# EAGLE design dawa_v5.1 (EAGLE 7.4.0)
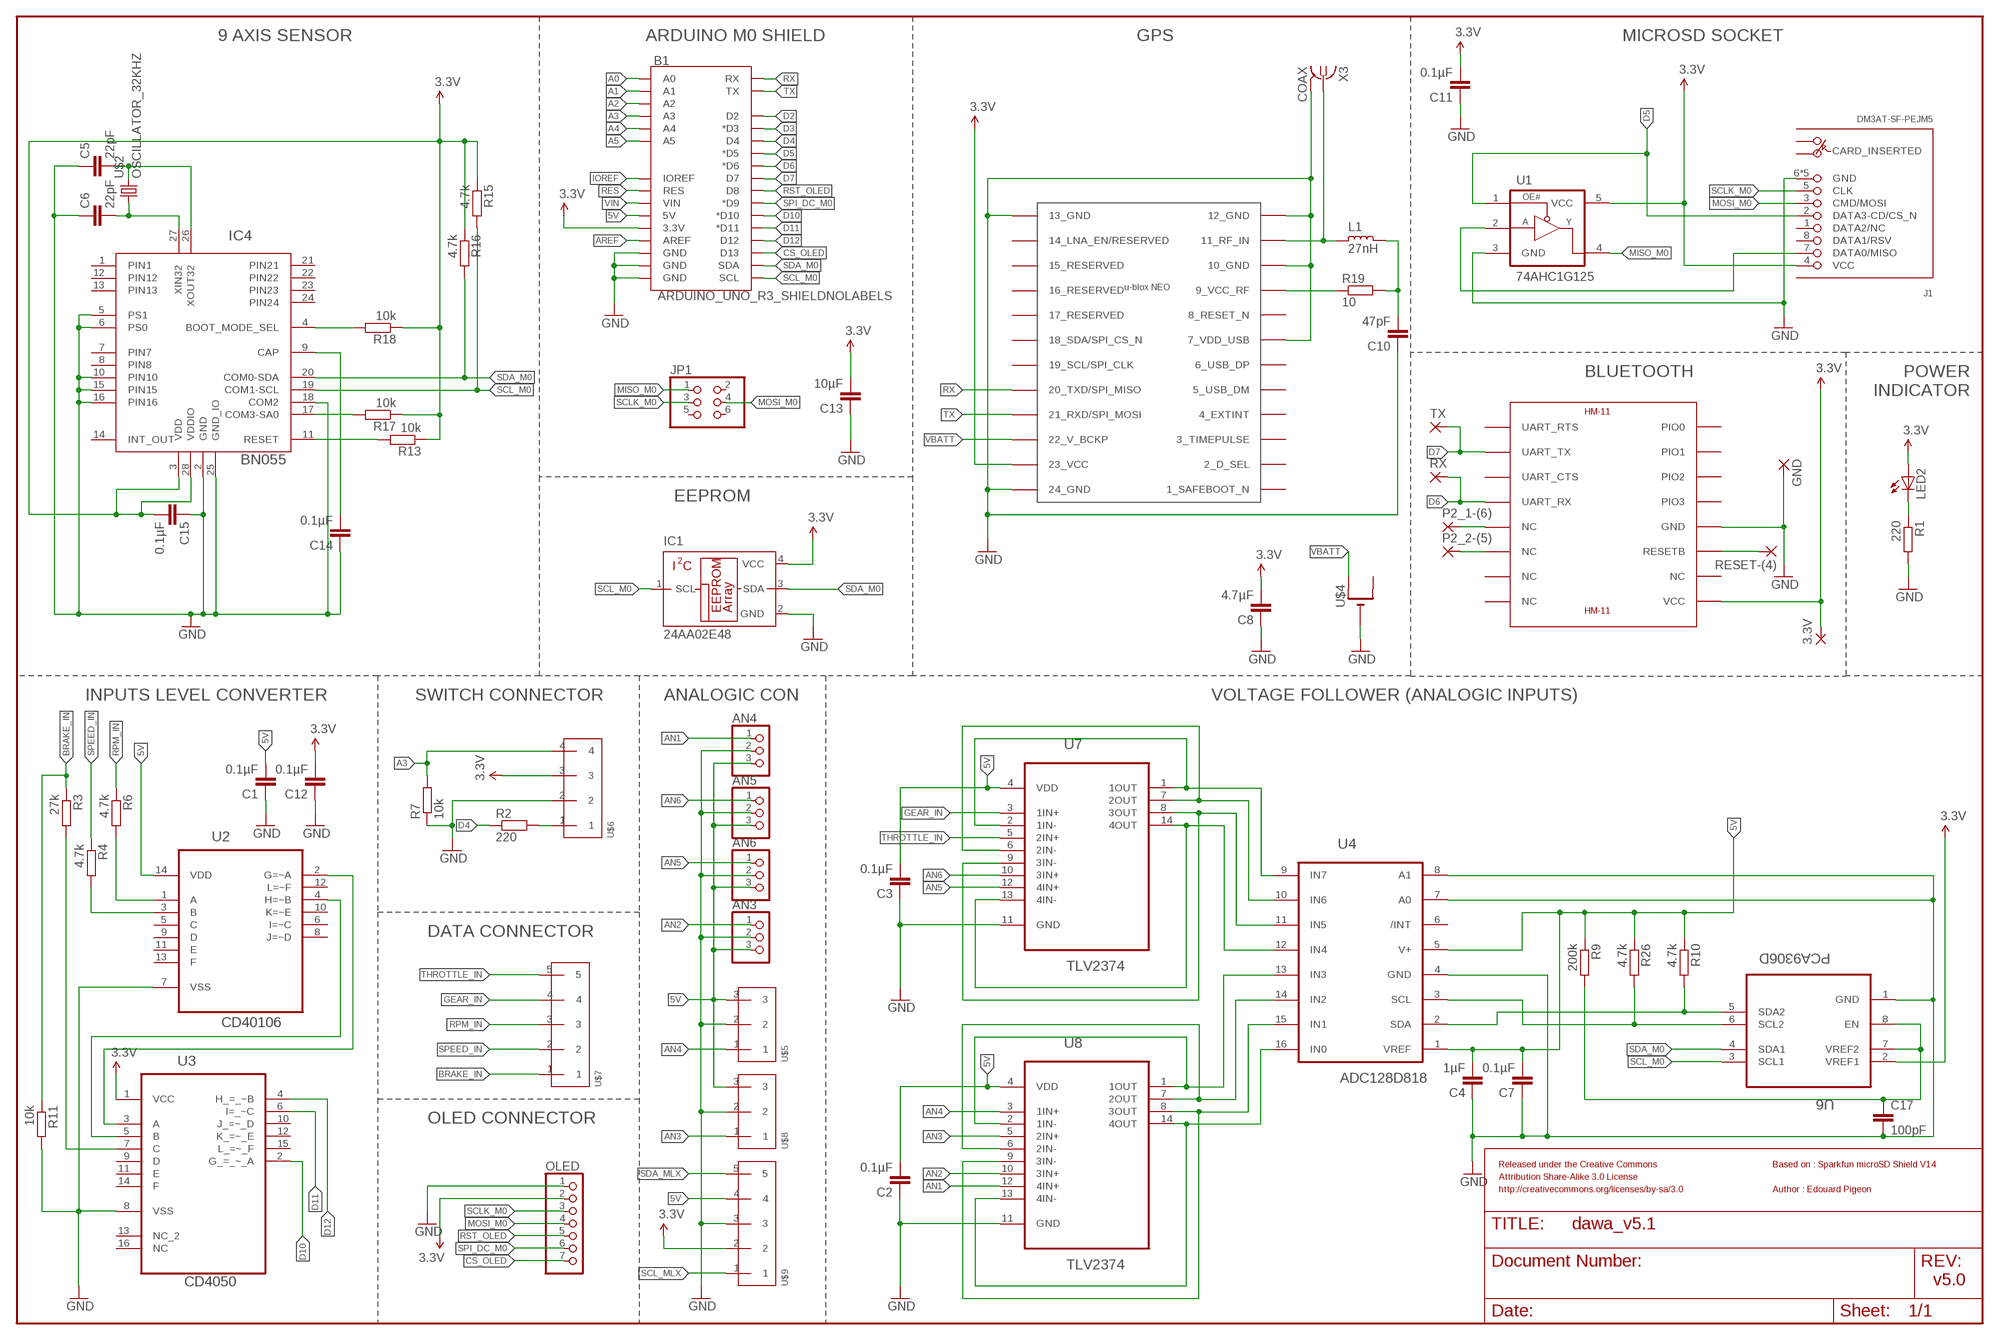
[diagram p0: schematic, sheet 1, part 1 of 2]
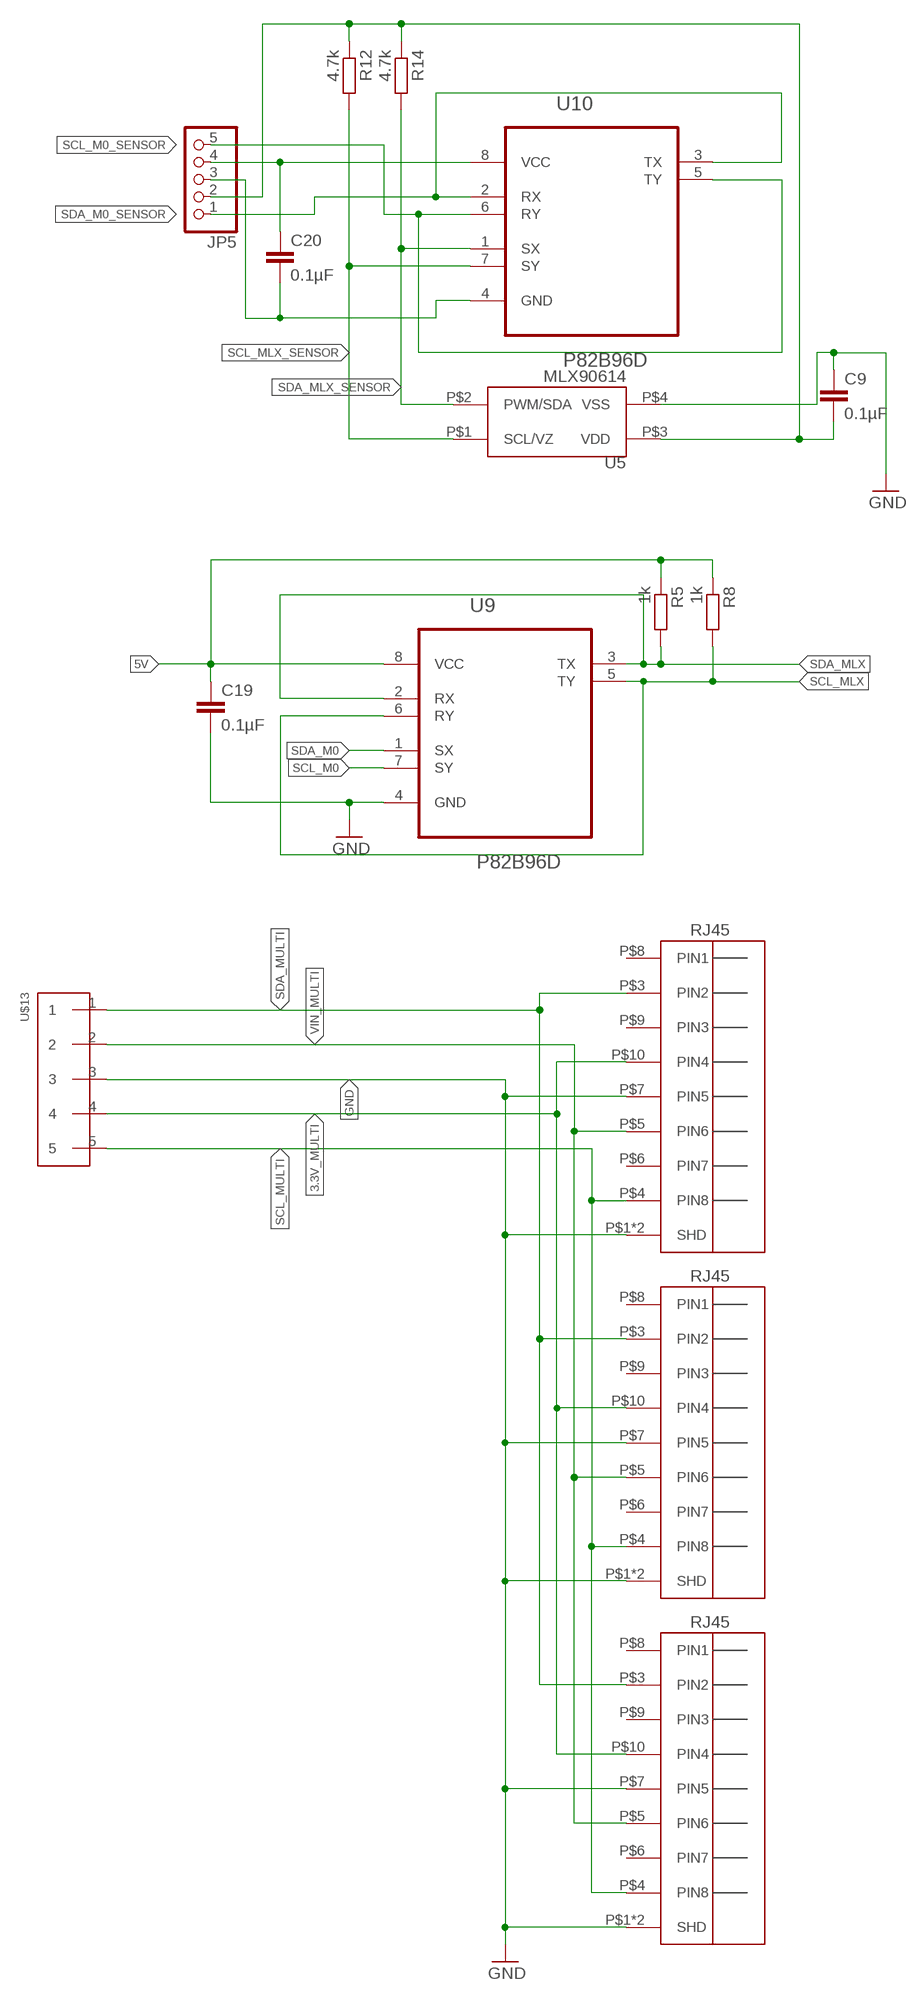
[diagram p1: schematic, sheet 1, part 2 of 2]

## Parts
3.3V  WIREPADSMD1,27-254  [SMD1,27-2,54]
AN3  PINHD-1X3  [1X03]
AN4  PINHD-1X3  [1X03]
AN5  PINHD-1X3  [1X03]
AN6  PINHD-1X3  [1X03]
B1  ARDUINO_UNO_R3_SHIELDNOLABELS  [UNO_R3_SHIELD_NOLABELS]
C1  0.1µF  C-EUC0603  [C0603]
C2  0.1µF  C-EUC0603  [C0603]
C3  0.1µF  C-EUC0603  [C0603]
C4  1µF  C-EUC0603  [C0603]
C5  22pF  C-EUC0603  [C0603]
C6  22pF  C-EUC0603  [C0603]
C7  0.1µF  C-EUC0603  [C0603]
C8  4.7µF  C-EUC0603  [C0603]
C9  0.1µF  C-EUC0603  [C0603]
C10  47pF  C-EUC0603  [C0603]
C11  0.1µF  C-EUC0603  [C0603]
C12  0.1µF  C-EUC0603  [C0603]
C13  10µF  C-EUC0603  [C0603]
C14  0.1µF  C-EUC0603  [C0603]
C15  0.1µF  C-EUC0603  [C0603]
C17  100pF  C-EUC0603  [C0603]
C19  0.1µF  C-EUC0603  [C0603]
C20  0.1µF  C-EUC0603  [C0603]
GND  WIREPADSMD1,27-254  [SMD1,27-2,54]
IC1  24AA02E48  24AA00OT  [SOT23-5L]
IC4  BN055  1658_BNO055  [LGA-28_3.80X5.20/0.5]
J1  DM3AT-SF-PEJM5  [DM3AT-SF-PEJM5]
JP1  PINHD-2X3  [2X03]
JP5  PINHD-1X5  [1X05]
L1  27nH  L_0603  [L0603]
LED2  LEDCHIPLED_1206  [CHIPLED_1206]
OLED  PINHD-1X7  [1X07]
P2_1-(6)  WIREPADSMD1,27-254  [SMD1,27-2,54]
P2_2-(5)  WIREPADSMD1,27-254  [SMD1,27-2,54]
R1  220  R-EU_R0603  [R0603]
R2  220  R-EU_R0603  [R0603]
R3  27k  R-EU_R0603  [R0603]
R4  4.7k  R-EU_R0603  [R0603]
R5  1k  R-EU_R0603  [R0603]
R6  4.7k  R-EU_R0603  [R0603]
R7  10k  R-EU_R0603  [R0603]
R8  1k  R-EU_R0603  [R0603]
R9  200k  R-EU_R0603  [R0603]
R10  4.7k  R-EU_R0603  [R0603]
R11  10k  R-EU_R0603  [R0603]
R12  4.7k  R-EU_R0603  [R0603]
R13  10k  R-EU_R0603  [R0603]
R14  4.7k  R-EU_R0603  [R0603]
R15  4.7k  R-EU_R0603  [R0603]
R16  4.7k  R-EU_R0603  [R0603]
R17  10k  R-EU_R0603  [R0603]
R18  10k  R-EU_R0603  [R0603]
R19  10  R-EU_M1206  [M1206]
R26  4.7k  R-EU_R0603  [R0603]
RESET-(4)  WIREPADSMD1,27-254  [SMD1,27-2,54]
RX  WIREPADSMD1,27-254  [SMD1,27-2,54]
TX  WIREPADSMD1,27-254  [SMD1,27-2,54]
U1  74AHC1G125  74AHC1G125DBV  [SOT23-5]
U2  CD40106  CD40106BPW  [SOP65P640X120-14N]
U3  CD4050  CD4049UBPW  [SOP65P640X120-16N]
U4  ADC128D818  [SOP65P640X120-16N]
U5  MLX90614  MLX90614_  [TO-39]
U6  PCA9306D  PCA9306DCUT  [SOP50P310X90-8N]
U7  TLV2374  TLV2374IPWR  [SOP65P640X120-14N]
U8  TLV2374  TLV2374IPWR  [SOP65P640X120-14N]
U9  P82B96D  [SOIC127P600X175-8N]
U10  P82B96D  [SOIC127P600X175-8N]
U$1  HM-11  [HM-11]
U$2  OSCILLATOR_32KHZ  [OSCILLATOR_SMD]
U$3  NEO-M8  [NEO-M8]
U$4  CR1220SMT  [CR1220-SMD]
U$5  3_PIN_JST-XH-SMD  [3_PIN_JST-XH-SMD]
U$6  4_PIN_JST-XH-SMD  [4_PIN_JST-XH-SMD]
U$7  5_PIN_JST-XH-SMD  [5_PIN_JST-XH-SMD]
U$8  3_PIN_JST-XH-SMD  [3_PIN_JST-XH-SMD]
U$9  5_PIN_JST-XH-SMD  [5_PIN_JST-XH-SMD]
U$10  RJ45  [RJ45]
U$11  RJ45  [RJ45]
U$12  RJ45  [RJ45]
U$13  5_PIN_JST-XH-SMD  [5_PIN_JST-XH-SMD]
X3  COAX  [MMCX-J-P-X-ST-EM1-MKT]

## Nets
3.3V: 3.3V.1(P) B1.3.3V C8.2 C11.2 C12.2 C13.2 C15.2 IC1.4(VCC) IC4.3(VDD) IC4.28(VDDIO) J1.4(VCC) LED2.A OLED.2 R13.1 R15.1 R16.1 R17.1 R18.1 U1.5(VCC) U3.1(VCC) U6.2(VREF1) U$1.VCC U$3.23(23_VCC) U$6.3 U$9.2
3.3V_MULTI: U$10.P$10(PIN4) U$11.P$10(PIN4) U$12.P$10(PIN4) U$13.4
5V: AN3.3 AN4.3 AN5.3 AN6.3 B1.5V C1.2 C2.2 C3.2 C4.2 C7.2 C19.1 R5.1 R8.1 R9.1 R10.1 R26.1 U2.14(VDD) U4.1(VREF) U4.5(V+) U7.4(VDD) U8.4(VDD) U9.8(VCC) U$5.3 U$8.3 U$9.4
A0: B1.A0
A1: B1.A1
A2: B1.A2
A3: B1.A3 R7.2 U$6.4
A4: B1.A4
A5: B1.A5
AN1: AN4.1 U8.12(4IN+)
AN2: AN3.1 U8.10(3IN+)
AN3: U8.5(2IN+) U$8.1
AN4: U8.3(1IN+) U$5.1
AN5: AN6.1 U7.12(4IN+)
AN6: AN5.1 U7.10(3IN+)
AREF: B1.AREF
BRAKE_IN: R3.1 R11.1 U$7.1
CS_OLED: B1.D13 OLED.7
D2: B1.D2
D3: B1.D3(*D3)
D4: B1.D4 R2.1
D5: B1.D5(*D5) J1.2(DATA3-CD/CS_N) U1.1(OE#)
D6: B1.D6(*D6) RX.1(P) U$1.UART_RX
D7: B1.D7 TX.1(P) U$1.UART_TX
D10: B1.D10(*D10) U3.2(G_=_~_A)
D11: B1.D11(*D11) U3.6(I=_~C)
D12: B1.D12 U3.4(H_=_~B)
GEAR_IN: U7.3(1IN+) U$7.4
GND: AN3.2 AN4.2 AN5.2 AN6.2 B1.GND@0(GND) B1.GND@1(GND) B1.GND@2(GND) C1.1 C2.1 C3.1 C4.1 C5.1 C6.1 C7.1 C8.1 C9.1 C10.1 C11.1 C12.1 C13.1 C14.1 C15.1 C17.2 C19.2 GND.1(P) IC1.2(GND) IC4.2(GND) IC4.5(PS1) IC4.6(PS0) IC4.10(PIN10) IC4.15(PIN15) IC4.16(PIN16) IC4.18(COM2) IC4.25(GND_IO) J1.6(GND) J1.MOUNT0(GND) J1.MOUNT1(GND) J1.MOUNT2(GND) J1.MOUNT3(GND) OLED.1 R1.2 R7.1 R11.2 U1.3(GND) U2.7(VSS) U3.8(VSS) U4.4(GND) U4.7(A0) U4.8(A1) U5.P$4(VSS) U6.1(GND) U7.11(GND) U8.11(GND) U9.4(GND) U$1.GND U$3.7(7_VDD_USB) U$3.10(10_GND) U$3.12(12_GND) U$3.13(13_GND) U$3.24(24_GND) U$4.- U$5.2 U$6.2 U$8.2 U$9.3 U$10.P$1(SHD) U$10.P$2(SHD) U$10.P$7(PIN5) U$11.P$1(SHD) U$11.P$2(SHD) U$11.P$7(PIN5) U$12.P$1(SHD) U$12.P$2(SHD) U$12.P$7(PIN5) U$13.3 X3.2@1(GND)
IOREF: B1.IOREF
MISO_M0: JP1.1 U1.4(Y)
MOSI_M0: J1.3(CMD/MOSI) JP1.4 OLED.4
N$1: R2.2 U$6.1
N$2: R6.2 U2.1(A)
N$3: U2.2(G=~A) U3.3(A)
N$4: R4.2 U2.3(B)
N$5: R3.2 U3.7(C)
N$6: LED2.C R1.1
N$7: IC4.11(RESET) R13.2
N$8: P2_1-(6).1(P) U$1.NC@5(NC)
N$9: RESET-(4).1(P) U$1.RESETB
N$10: J1.7(DATA0/MISO) U1.2(A)
N$11: C10.2 L1.1 R19.2
N$12: U4.13(IN3) U8.1(1OUT) U8.2(1IN-)
N$13: C14.2 IC4.9(CAP)
N$14: IC4.4(BOOT_MODE_SEL) R18.2
N$15: C5.2 IC4.26(XOUT32) U$2.2
N$16: C6.2 IC4.27(XIN32) U$2.1
N$17: IC4.17(COM3-SA0) R17.2
N$18: P2_2-(5).1(P) U$1.NC@6(NC)
N$19: R19.1 U$3.9(9_VCC_RF)
N$20: L1.2 U$3.11(11_RF_IN) X3.1
N$21: U2.4(H=~B) U3.5(B)
N$22: R26.2 U4.3(SCL) U6.6(SCL2)
N$23: R10.2 U4.2(SDA) U6.5(SDA2)
N$24: U4.9(IN7) U7.1(1OUT) U7.2(1IN-)
N$25: U4.10(IN6) U7.6(2IN-) U7.7(2OUT)
N$26: U4.11(IN5) U7.8(3OUT) U7.9(3IN-)
N$27: U4.12(IN4) U7.13(4IN-) U7.14(4OUT)
N$28: C17.1 R9.2 U6.7(VREF2) U6.8(EN)
N$29: U4.14(IN2) U8.6(2IN-) U8.7(2OUT)
N$30: U4.15(IN1) U8.8(3OUT) U8.9(3IN-)
N$31: U4.16(IN0) U8.13(4IN-) U8.14(4OUT)
N$37: C20.1 JP5.4 U10.8(VCC)
N$41: C9.2 JP5.2 R12.1 R14.1 U5.P$3(VDD)
N$42: C20.2 JP5.3 U10.4(GND)
RES: B1.RES
RPM_IN: R6.1 U$7.3
RST_OLED: B1.D8 OLED.5
RX: B1.RX U$3.20(20_TXD/SPI_MISO)
SCL_M0: B1.SCL IC1.1(SCL) IC4.19(COM1-SCL) R15.2 U6.3(SCL1) U9.7(SY)
SCL_M0_SENSOR: JP5.5 U10.5(TY) U10.6(RY)
SCL_MLX: R8.2 U9.5(TY) U9.6(RY) U$9.1
SCL_MLX_SENSOR: R12.2 U5.P$1(SCL/VZ) U10.7(SY)
SCL_MULTI: U$10.P$4(PIN8) U$11.P$4(PIN8) U$12.P$4(PIN8) U$13.5
SCLK_M0: J1.5(CLK) JP1.3 OLED.3
SDA_M0: B1.SDA IC1.3(SDA) IC4.20(COM0-SDA) R16.2 U6.4(SDA1) U9.1(SX)
SDA_M0_SENSOR: JP5.1 U10.2(RX) U10.3(TX)
SDA_MLX: R5.2 U9.2(RX) U9.3(TX) U$9.5
SDA_MLX_SENSOR: R14.2 U5.P$2(PWM/SDA) U10.1(SX)
SDA_MULTI: U$10.P$3(PIN2) U$11.P$3(PIN2) U$12.P$3(PIN2) U$13.1
SPEED_IN: R4.1 U$7.2
SPI_DC_M0: B1.D9(*D9) OLED.6
THROTTLE_IN: U7.5(2IN+) U$7.5
TX: B1.TX U$3.21(21_RXD/SPI_MOSI)
VBATT: U$3.22(22_V_BCKP) U$4.+$1(+)
VIN: B1.VIN
VIN_MULTI: U$10.P$5(PIN6) U$11.P$5(PIN6) U$12.P$5(PIN6) U$13.2
Unconnected: IC4.1(PIN1) IC4.7(PIN7) IC4.8(PIN8) IC4.12(PIN12) IC4.13(PIN13) IC4.14(INT_OUT) IC4.21(PIN21) IC4.22(PIN22) IC4.23(PIN23) IC4.24(PIN24) J1.1(DATA2/NC) J1.8(DATA1/RSV) J1.A J1.B JP1.2 JP1.5 JP1.6 U2.5(C) U2.6(I=~C) U2.8(J=~D) U2.9(D) U2.10(K=~E) U2.11(E) U2.12(L=~F) U2.13(F) U3.9(D) U3.10(J_=~_D) U3.11(E) U3.12(K_=~_E) U3.13(NC_2) U3.14(F) U3.15(L_=~_F) U3.16(NC) U4.6(/INT) U$1.NC@7(NC) U$1.NC@8(NC) U$1.NC@10(NC) U$1.PIO0 U$1.PIO1 U$1.PIO2 U$1.PIO3 U$1.UART_CTS U$1.UART_RTS U$3.1(1_SAFEBOOT_N) U$3.2(2_D_SEL) U$3.3(3_TIMEPULSE) U$3.4(4_EXTINT) U$3.5(5_USB_DM) U$3.6(6_USB_DP) U$3.8(8_RESET_N) U$3.14(14_LNA_EN/RESERVED) U$3.15(15_RESERVED) U$3.16(16_RESERVED) U$3.17(17_RESERVED) U$3.18(18_SDA/SPI_CS_N) U$3.19(19_SCL/SPI_CLK) U$4.+$2(+1) U$10.P$6(PIN7) U$10.P$8(PIN1) U$10.P$9(PIN3) U$11.P$6(PIN7) U$11.P$8(PIN1) U$11.P$9(PIN3) U$12.P$6(PIN7) U$12.P$8(PIN1) U$12.P$9(PIN3)

## Notes on the sheet
- 9 AXIS SENSOR | ARDUINO M0 SHIELD | GPS | MICROSD SOCKET
- POWER
  INDICATOR
- BLUETOOTH
- EEPROM
- INPUTS LEVEL CONVERTER
- SWITCH CONNECTOR | ANALOGIC CON | VOLTAGE FOLLOWER (ANALOGIC INPUTS)
- DATA CONNECTOR
- OLED CONNECTOR
- Released under the Creative Commons | Based on : Sparkfun microSD Shield V14
- Attribution Share-Alike 3.0 License
- http://creativecommons.org/licenses/by-sa/3.0 | Author : Edouard Pigeon
- v5.0

## Power pins joined to a net without a drawn wire
GND: X3.2@2(GND) X3.2@3(GND) X3.2@4(GND)

## Library data of the parts
3.3V GND P2_1-(6) P2_2-(5) RESET-(4) RX TX = wirepad:WIREPAD: Wire PAD connect wire on PCB
AN3-AN6 = adafruit:PINHD-1X3: PIN HEADER
B1 = SparkFun-Boards-resize:ARDUINO_UNO_R3_SHIELD: Arduino R3 Shield Footprint Shield form compatible with the Arduino Uno R3. SparkFun Products: MG2639 Cellular Shield <https://www.sparkfun.com/products/13120> MIDI Shield <https://www.sparkfun.com/products/12898> R3 Stackable Headers Kit <https://www.sparkfun.com/products/11417>
C1-C15 C17 C19 C20 = rcl:C-EU: CAPACITOR, European symbol
IC1 = microchip:24*00: Serial EEPROM 128 bit, I2C (AA = 1.8 V/LC = 2.5 V/C = 5.0 V); MF: MICROCHIP; MPN: 24AA00T-I/OTG; OC_FARNELL: 1331264; OC_NEWARK: 89H3038
IC4 = BNO055-2:1658_BNO055: BN055 Intelligent 9-axis absolute orientation sensor; PART_NUMBER: BNO055
J1 = connector-hirose:DM3AT-SF-PEJM5: CONN MICRO SD R/A PUSH-PUSH SMD; DIGIKEY: HR1964CT-ND
JP1 = pinhead:PINHD-2X3: PIN HEADER
JP5 = pinhead:PINHD-1X5: PIN HEADER
L1 = rc-master-smd:L_: INDUCTOR
LED2 = led:LED: LED OSRAM: - CHIPLED LG R971, LG N971, LY N971, LG Q971, LY Q971, LO R971, LY R971 LH N974, LH R974 LS Q976, LO Q976, LY Q976 LO Q996 - Hyper CHIPLED LW Q18S LB Q993, LB Q99A, LB R99A - SideLED LS A670, LO A670, LY A670, LG A670, LP A670 LB A673, LV A673, LT A673, LW A673 LH A674 LY A675 LS A676, LA A676, LO A676, LY A676, LW A676 LS A679, LY A679, LG A679 - Hyper Micro SIDELED® LS Y876, LA Y876, LO Y876, LY Y876 LT Y87S - SmartLED LW L88C, LW L88S LB L89C, LB L89S, LG L890 LS L89K, LO L89K, LY L89K LS L896, LA L896, LO L896, LY L896 - TOPLED LS T670, LO T670, LY T670, LG T670, LP T670 LSG T670, LSP T670, LSY T670, LOP T670, LYG T670 LG T671, LOG T671, LSG T671 LB T673, LV T673, LT T673, LW T673 LH T674 LS T676, LA T676, LO T676, LY T676, LB T676, LH T676, LSB T676, LW T676 LB T67C, LV T67C, LT T67C, LS T67K, LO T67K, LY T67K, LW E67C LS E67B, LA E67B, LO E67B, LY E67B, LB E67C, LV E67C, LT E67C LW T67C LS T679, LY T679, LG T679 LS T770, LO T770, LY T770, LG T770, LP T770 LB T773, LV T773, LT T773, LW T773 LH T774 LS E675, LA E675, LY E675, LS T675 LS T776, LA T776, LO T776, LY T776, LB T776 LHGB T686 LT T68C, LB T68C - Hyper Mini TOPLED® LB M676 - Mini TOPLED Santana® LG M470 LS M47K, LO M47K, LY M47K Source: http://www.osram.convergy.de LUXEON: - LUMILED® LXK2-PW12-R00, LXK2-PW12-S00, LXK2-PW14-U00, LXK2-PW14-V00 LXK2-PM12-R00, LXK2-PM12-S00, LXK2-PM14-U00 LXK2-PE12-Q00, LXK2-PE12-R00, LXK2-PE12-S00, LXK2-PE14-T00, LXK2-PE14-U00 LXK2-PB12-K00, LXK2-PB12-L00, LXK2-PB12-M00, LXK2-PB14-N00, LXK2-PB14-P00, LXK2-PB14-Q00 LXK2-PR12-L00, LXK2-PR12-M00, LXK2-PR14-Q00, LXK2-PR14-R00 LXK2-PD12-Q00, LXK2-PD12-R00, LXK2-PD12-S00 LXK2-PH12-R00, LXK2-PH12-S00 LXK2-PL12-P00, LXK2-PL12-Q00, LXK2-PL12-R00 Source: www.luxeon.com KINGBRIGHT: KA-3528ASYC Source: www.kingbright.com
OLED = pinhead:PINHD-1X7: PIN HEADER
R1-R19 R26 = resistor:R-EU_: RESISTOR, European symbol
U1 = 74ah:74AHC1G125: TRI-STATE SINGLE BUSS BUFFER
U2 = TI:CD40106BPW: QUADRUPLE FET BUS SWITCH 2.5-V/3.3-V LOW-VOLTAGE BUS SWITCH WITH 5-V-TOLERANT LEVEL SHIFTER; MPN: CD40106BPW; OC_FARNELL: 1741145; OC_NEWARK: 34R6794; PACKAGE: TSSOP-14; SUPPLIER: Texas Instruments
U3 = TI:CD4049UBPW: CMOS Hex Buffer/Converters; MPN: CD4049UBPW; OC_FARNELL: 1740863; OC_NEWARK: 50R5061; PACKAGE: TSSOP-16; SUPPLIER: Texas Instruments
U4 = ADS128D818-2:ADC128D818: ADC
U5 = SparkFun-MLX:MLX90614: Melexis IR Thermometer
U6 = TI:PCA9306DCUT: VOLTAGE-LEVEL TRANSLATOR; MPN: PCA9306DCUT; OC_FARNELL: -; OC_NEWARK: 24K4705; PACKAGE: VSSOP-8; SUPPLIER: Texas Instruments
U7 U8 = TI:TLV2374IPWR: OPERATIONAL AMPLIFIERS; MPN: TLV2374IPWR; OC_FARNELL: 1575640; OC_NEWARK: 76C7986; PACKAGE: SOIC-14; SUPPLIER: Texas Instruments
U9 U10 = TI:P82B96D: DUAL BIDIRECTIONAL BUS BUFFER; MPN: P82B96D; OC_FARNELL: 1831235; OC_NEWARK: 88K6383; PACKAGE: SOIC-8; SUPPLIER: Texas Instruments
U$1 = hm-11:HM-11: JNHuaMao HM-11 Bluetooth 4.0 Transceiver based on TI CC2540/CC2541
U$2 = kanflo:OSCILLATOR_32KHZ: CM7V-T1A Tuning Fork Crystal 32.768 kHz
U$3 = ubloxLib:NEO-M8: u-blox NEO GNSS module
U$4 = adafruit:CR1220: CR1216/CR1220/CR1225 12mm 3V lithium coin cell Great for battery packup. Both SMT and THM holders. Note the THM package has the ground pads on both sides of the PCB so that the masks are the same - this reduces the cost
U$5 U$8 = JST-XH_HEADERS:3_PIN_JST-XH-SMD
U$6 = JST-XH_HEADERS:4_PIN_JST-XH-SMD
U$7 U$9 U$13 = JST-XH_HEADERS:5_PIN_JST-XH-SMD
U$10-U$12 = RJ45 Jack:RJ45
X3 = con-samtec:COAX: MMCX STRAIGHT, EDGE MOUNT JACK- 50 OHM Source: http://www.samtec.com/ftppub/cpdf/MMCX-J-P-X-ST-EM1-MKT.pdf; OC_FARNELL: unknown; OC_NEWARK: unknown

## Board
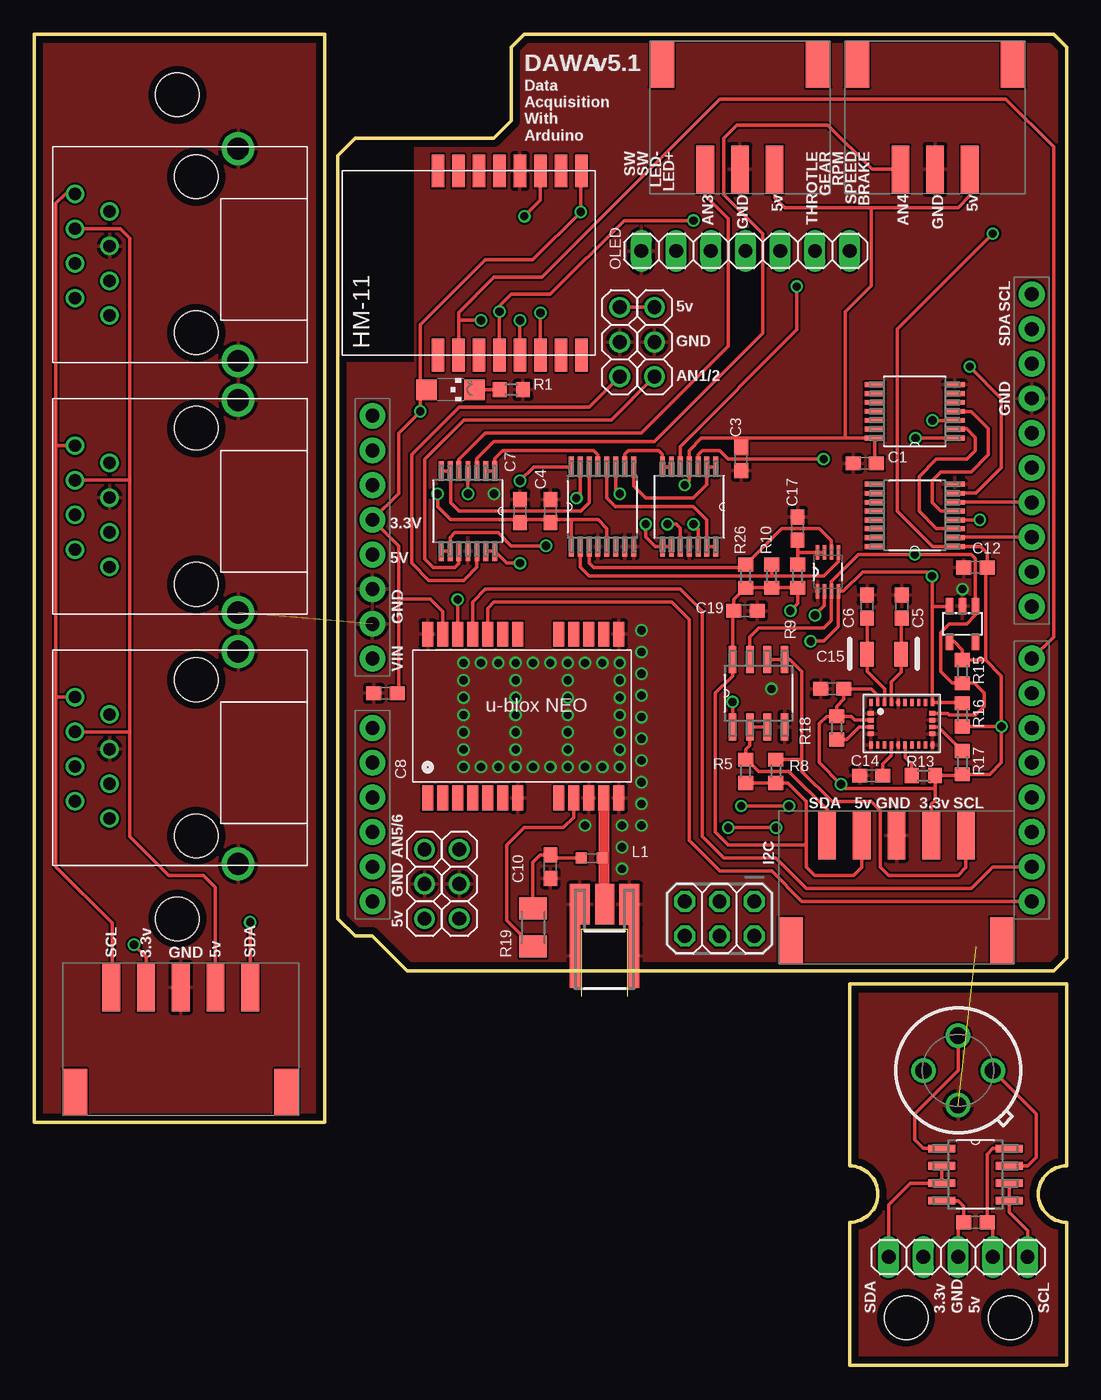
[diagram p2: board, top side]
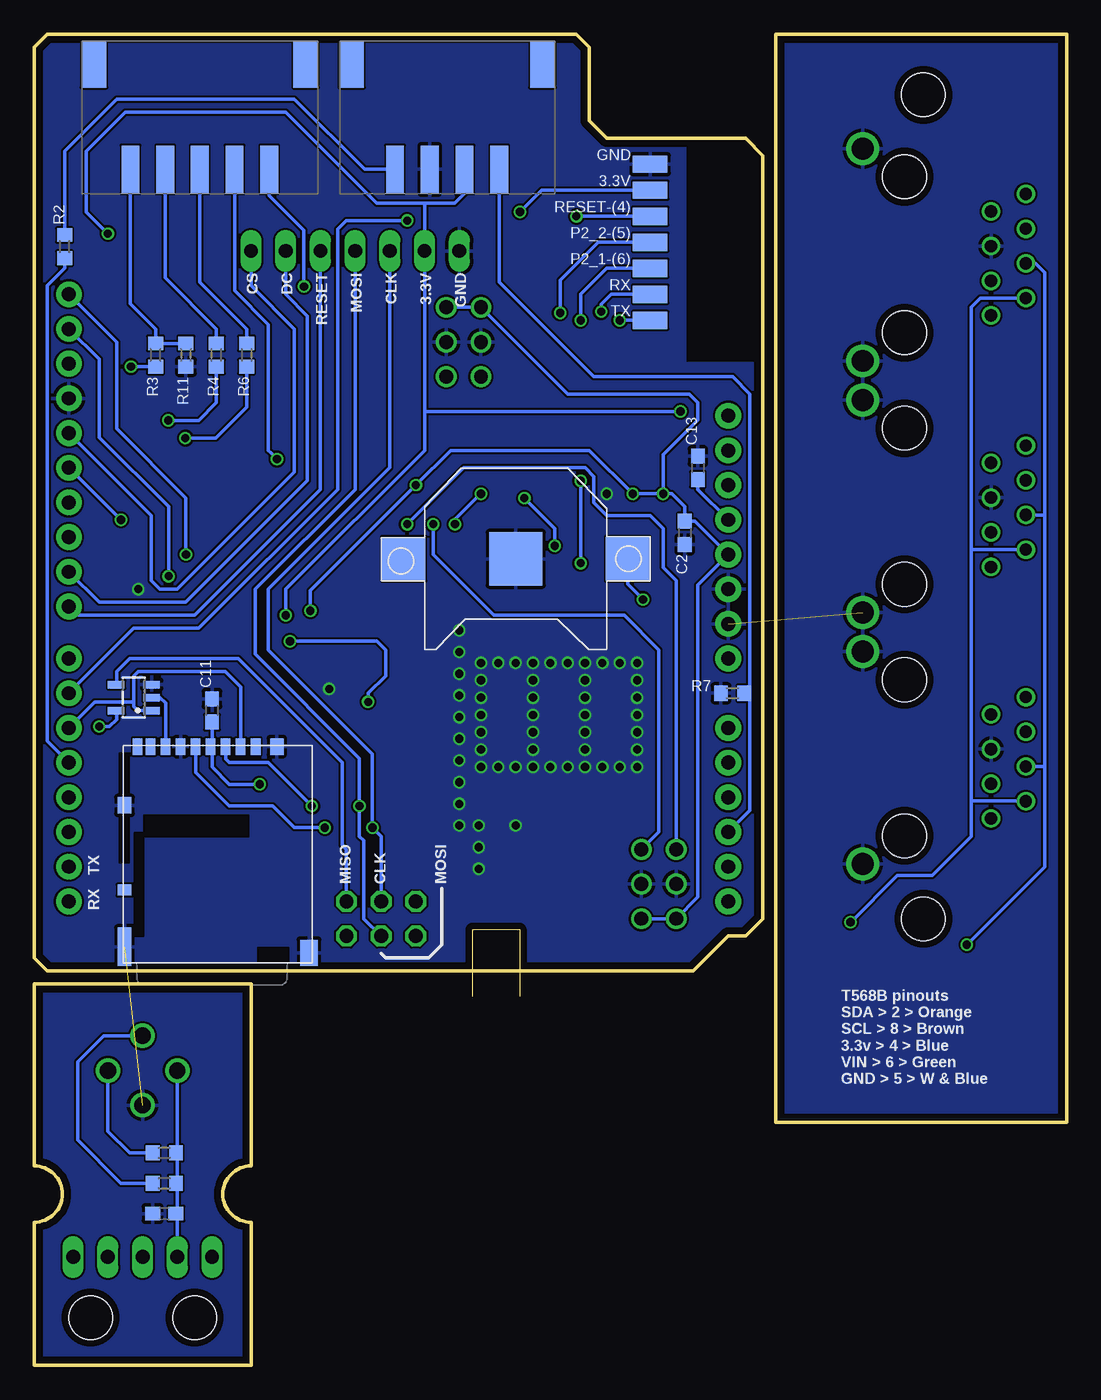
[diagram p3: board, bottom side, seen from below]

Size 75.56 x 97.47 mm. Coordinates in mm from the lower left corner, seen from the top.
Outline: 75.56,96.52 75.56,29.84 74.61,28.89 27.3,28.89 24.77,31.43 23.49,31.43 22.23,32.7 22.23,88.58 23.49,89.85 33.66,89.85 34.92,91.12 34.92,96.52 35.88,97.47 74.61,97.47 75.56,96.52
Outline: 59.69,27.94 75.56,27.94 75.56,14.6 arc180 75.56,10.48 75.56,0 59.69,0 59.69,10.48 arc180 59.69,14.6 59.69,27.94
Outline: 0,17.78 21.27,17.78 21.27,97.47 0,97.47 0,17.78
Copper layers (1*16): Top 0.035mm / dielectric 1.6mm / Bottom 0.035mm
Design rules "Elecrow_2-layer_PCB_eagle_rule": minimum track width 6mil, minimum drill 12mil, track to track 6mil, track to pad 6mil, pad to pad 6mil, via to via 8mil, smd to smd 0mil, copper to edge 20mil, drill to drill 10mil, minimum pad ring 6mil, minimum via ring 6mil, stop-mask expansion 0mil, vias tented up to drill 100mil, thermal gap 10mil
Holes 3.2 mm at 71.44,3.49 63.82,3.49 10.48,93.03 10.48,32.7

### Footprints (pad centres in the part's own frame; a part is rotated, then mirrored left to right if it is on the bottom)
SMD1,27-2,54 = smd 1.27 x 2.54: 1 0,0
1X03 = drill 1.016: 1 -2.54,0; 2 0,0; 3 2.54,0
UNO_R3_SHIELD_NOLABELS = drill 1.016 pad 1.88: 3.3V 24.13,-3.81; 5V 24.13,-1.27; A0 24.13,11.43; A1 24.13,13.97; A2 24.13,16.51; A3 24.13,19.05; A4 24.13,21.59; A5 24.13,24.13; AREF -24.13,-15.24; D2 -24.13,19.05; D3 -24.13,16.51; D4 -24.13,13.97; D5 -24.13,11.43; D6 -24.13,8.89; D7 -24.13,6.35; D8 -24.13,2.54; D9 -24.13,0; D10 -24.13,-2.54; D11 -24.13,-5.08; D12 -24.13,-7.62; D13 -24.13,-10.16; GND@0 24.13,1.27; GND@1 24.13,3.81; GND@2 -24.13,-12.7; IOREF 24.13,-8.89; NC 24.13,-11.43; RES 24.13,-6.35; RX -24.13,24.13; SCL -24.13,-20.32; SDA -24.13,-17.78; TX -24.13,21.59; VIN 24.13,6.35
C0603 = smd 1.1 x 1: 1 -0.85,0; 2 0.85,0
SOT23-5L = smd 0.55 x 1.2: 1 -0.95,-1.3; 2 0,-1.3; 3 0.95,-1.3; 4 0.95,1.3; 5 -0.95,1.3
LGA-28_3.80X5.20/0.5 = smd 0.3 x 0.5: 1 -2.25,1.56; 6 -2.25,-1.56; 7 -1.75,-1.56; 8 -1.25,-1.56; 9 -0.75,-1.56; 10 -0.25,-1.56; 11 0.25,-1.56; 12 0.75,-1.56; 13 1.25,-1.56; 14 1.75,-1.56; 15 2.25,-1.56; 20 2.25,1.56; 21 1.75,1.56; 22 1.25,1.56; 23 0.75,1.56; 24 0.25,1.56; 25 -0.25,1.56; 26 -0.75,1.56; 27 -1.25,1.56; 28 -1.75,1.56 | smd 0.5 x 0.3: 2 -2.25,0.75; 3 -2.25,0.25; 4 -2.25,-0.25; 5 -2.25,-0.75; 16 2.25,-0.75; 17 2.25,-0.25; 18 2.25,0.25; 19 2.25,0.75
DM3AT-SF-PEJM5 = smd 0.7 x 1.2: 1 3.2,-0.1; 2 2.1,-0.1; 3 1,-0.1; 4 -0.1,-0.1; 5 -1.2,-0.1; 6 -2.3,-0.1; 7 -3.4,-0.1; 8 -4.5,-0.1; B -5.45,-0.1 | smd 1 x 0.8: A -6.4,-10.6 | smd 1 x 1.2: MOUNT0 4.75,-0.1; MOUNT1 -6.4,-4.4 | smd 1 x 2.8: MOUNT2 -6.4,-14.75 | smd 1.3 x 1.9: MOUNT3 7.1,-15.2
2X03 = drill 1.016 octagon: 1 -2.54,-1.27; 2 -2.54,1.27; 3 0,-1.27; 4 0,1.27; 5 2.54,-1.27; 6 2.54,1.27
1X05 = drill 1.016 long: 1 -5.08,0; 2 -2.54,0; 3 0,0; 4 2.54,0; 5 5.08,0
L0603 = smd 0.8 x 0.8: 1 -0.762,0; 2 0.762,0
CHIPLED_1206 = smd 1.5 x 1.5: A 0,-1.75; C 0,1.75
1X07 = drill 1.016 long: 1 -7.62,0; 2 -5.08,0; 3 -2.54,0; 4 0,0; 5 2.54,0; 6 5.08,0; 7 7.62,0
R0603 = smd 1 x 1.1: 1 -0.85,0; 2 0.85,0
M1206 = smd 1.6 x 2: 1 -1.4,0; 2 1.4,0
SOT23-5 = smd 0.55 x 1.2: 1 -0.95,-1.3; 2 0,-1.3; 3 0.95,-1.3; 4 0.95,1.3; 5 -0.95,1.3
SOP65P640X120-14N = smd 1.473 x 0.356: 1 -2.921,1.956; 2 -2.921,1.295; 3 -2.921,0.66; 4 -2.921,0; 5 -2.921,-0.66; 6 -2.921,-1.295; 7 -2.921,-1.956; 8 2.921,-1.956; 9 2.921,-1.295; 10 2.921,-0.66; 11 2.921,0; 12 2.921,0.66; 13 2.921,1.295; 14 2.921,1.956
SOP65P640X120-16N = smd 1.473 x 0.356: 1 -2.921,2.286; 2 -2.921,1.626; 3 -2.921,0.965; 4 -2.921,0.33; 5 -2.921,-0.33; 6 -2.921,-0.965; 7 -2.921,-1.626; 8 -2.921,-2.286; 9 2.921,-2.286; 10 2.921,-1.626; 11 2.921,-0.965; 12 2.921,-0.33; 13 2.921,0.33; 14 2.921,0.965; 15 2.921,1.626; 16 2.921,2.286
TO-39 = drill 1.2: P$1 2.54,0; P$2 0,2.54; P$3 -2.54,0; P$4 0,-2.54
SOP50P310X90-8N = smd 1.067 x 0.254: 1 -1.422,0.762; 2 -1.422,0.254; 3 -1.422,-0.254; 4 -1.422,-0.762; 5 1.422,-0.762; 6 1.422,-0.254; 7 1.422,0.254; 8 1.422,0.762
SOIC127P600X175-8N = smd 1.981 x 0.559: 1 -2.464,1.905; 2 -2.464,0.635; 3 -2.464,-0.635; 4 -2.464,-1.905; 5 2.464,-1.905; 6 2.464,-0.635; 7 2.464,0.635; 8 2.464,1.905
HM-11 = smd 2.4 x 0.9: GND 6.5,0; NC@5 -7,0; NC@6 -7,-1.5; NC@7 -7,-3; NC@8 -7,-4.5; NC@10 6.5,-3; PIO0 6.5,6; PIO1 6.5,4.5; PIO2 6.5,3; PIO3 6.5,1.5; RESETB 6.5,-1.5; UART_CTS -7,3; UART_RTS -7,6; UART_RX -7,1.5; UART_TX -7,4.5; VCC 6.5,-4.5
OSCILLATOR_SMD = smd 1 x 1.8: 1 0,0; 2 2.5,0
NEO-M8 = smd 1.8 x 0.8: 1 6.4,-7.4; 2 6.4,-6.3; 3 6.4,-5.2; 4 6.4,-4.1; 5 6.4,-3; 6 6.4,-1.9; 7 6.4,-0.8; 8 6.4,2.2; 9 6.4,3.3; 10 6.4,4.4; 11 6.4,5.5; 12 6.4,6.6; 13 -5.6,6.6; 14 -5.6,5.5; 15 -5.6,4.4; 16 -5.6,3.3; 17 -5.6,2.2; 18 -5.6,-0.8; 19 -5.6,-1.9; 20 -5.6,-3; 21 -5.6,-4.1; 22 -5.6,-5.2; 23 -5.6,-6.3; 24 -5.6,-7.4
CR1220-SMD = smd 3.2 x 3.2: +$1 -8.2,0; +$2 8.2,0 | smd 3.9 x 3.9: - 0,0
3_PIN_JST-XH-SMD = smd 1.3 x 3.5: 1 6.604,-0.254; 2 4.064,-0.254; 3 1.524,-0.254 | smd 1.8 x 3.4: P$1 9.779,-7.938; P$2 -1.651,-7.938
4_PIN_JST-XH-SMD = smd 1.3 x 3.5: 1 6.604,-0.254; 2 4.064,-0.254; 3 1.524,-0.254; 4 -1.016,-0.254 | smd 1.8 x 3.4: P$1 9.779,-7.938; P$2 -4.191,-7.938
5_PIN_JST-XH-SMD = smd 1.3 x 3.5: 1 6.604,-0.254; 2 4.064,-0.254; 3 1.524,-0.254; 4 -1.016,-0.254; 5 -3.556,-0.254 | smd 1.8 x 3.4: P$1 9.271,-7.938; P$2 -6.223,-7.938
RJ45 = drill 1.6: P$1 5.08,0.13; P$2 5.08,15.67 | drill 0.9: P$3 17.02,11.075; P$4 17.02,3.455; P$5 17.02,5.995; P$6 14.48,4.725; P$7 14.48,7.265; P$8 14.48,12.345; P$9 14.48,9.805; P$10 17.02,8.535 | hole 3.2: 8.14,2.185; 8.14,13.615
MMCX-J-P-X-ST-EM1-MKT = smd 1.4 x 2.975: 1 0,-6.15 | smd 1.46 x 2.975: 2@1 -1.812,-6.125; 2@2 1.812,-6.138 | smd 0.76 x 4.7: 2@3 -2.163,-2.35; 2@4 2.163,-2.35

### Placement (x,y rotation side)
3.3V  30.48,86.04 90 bottom
AN3  45.4,74.93 90 top
AN4  42.86,74.93 90 top
AN5  31.12,35.24 270 top
AN6  28.58,35.24 270 top
B1  48.9,58.1 180 top
C1  60.8,66.04 0 top
C2  27.94,60.96 90 bottom
C3  51.75,66.36 90 top
C4  37.78,62.55 270 top
C5  63.5,55.56 270 top
C6  60.96,55.56 270 top
C7  35.56,62.55 270 top
C8  25.72,49.21 0 top
C9  66.04,11.11 0 bottom
C10  37.78,36.51 90 top
C11  62.55,47.94 270 bottom
C12  68.9,58.42 0 top
C13  26.99,65.72 270 bottom
C14  61.28,43.18 0 top
C15  58.42,49.53 0 top
C17  55.88,61.28 90 top
C19  52.07,55.24 0 top
C20  68.9,10.48 180 top
GND  30.48,87.95 90 bottom
IC1  67.94,54.29 180 top
IC4  63.5,46.99 0 top
J1  62.55,45.4 0 bottom
JP1  50.16,32.7 180 top
JP5  67.63,7.94 0 top
L1  40.8,37.15 0 top
LED2  30.48,71.44 270 top
OLED  52.07,81.6 0 top
P2_1-(6)  30.48,80.33 90 bottom
P2_2-(5)  30.48,82.23 90 bottom
R1  34.92,71.44 0 top
R2  73.34,81.91 90 bottom
R3  66.67,73.98 270 bottom
R4  62.23,73.98 270 bottom
R5  52.07,43.5 90 top
R6  60.01,73.98 270 bottom
R7  24.45,49.21 0 bottom
R8  54.29,43.5 90 top
R9  55.88,57.78 90 top
R10  53.98,57.78 90 top
R11  64.45,73.98 270 bottom
R12  66.04,15.56 180 bottom
R13  65.09,43.18 180 top
R14  66.04,13.33 180 bottom
R15  67.94,50.8 270 top
R16  67.94,47.62 90 top
R17  67.94,44.13 90 top
R18  58.74,46.67 270 top
R19  36.51,32.07 90 top
R26  52.07,57.78 90 top
RESET-(4)  30.48,84.14 90 bottom
RX  30.48,78.42 270 bottom
TX  30.48,76.52 270 bottom
U1  68.26,48.89 90 bottom
U2  64.45,69.85 180 top
U3  64.45,62.23 180 top
U4  41.59,62.86 90 top
U5  67.63,21.59 0 top
U6  58.1,58.1 90 top
U7  47.94,62.86 270 top
U8  31.75,62.55 270 top
U9  53.02,49.21 90 top
U10  68.9,13.97 0 top
U$1  35.56,80.96 90 top
U$2  60.96,52.07 0 top
U$3  36.2,47.94 270 top
U$4  40.32,59.05 180 bottom
U$5  70.01,87.31 180 top
U$6  42.55,87.31 180 bottom
U$7  61.91,87.31 180 bottom
U$8  55.72,87.31 180 top
U$9  61.59,39.05 0 top
U$10  20,52.39 180 top
U$11  20,70.8 180 top
U$12  20,89.22 180 top
U$13  9.21,27.94 0 top
X3  41.75,27.62 180 top

### Tracks (layer width: path | path; a pad name or v marks a point on that pad's centre or on a via)
3.3V  (via drill 0.6)
  Top 0.254: 65.94,42.23 59.37,42.23 v59.05,42.54 57.47,44.13 57.47,46.99 58,47.52 R18.1 | IC4.3 60.08,47.24 59.79,47.52 R18.1 | IC4.28 61.75,49.06 61.28,49.53 C15.2 59.27,48.79 58.74,48.26 R18.1 | v70.8,46.77 70.8,44.13 69.95,43.28 R17.1 67.52,43.18 R13.1 65.94,42.23 | v70.8,46.77 70.8,50.48 69.64,51.65 | 69.64,51.65 R15.1 67.94,52.39 67.34,52.99 IC1.4 | U$3.23 29.9,55.19 28.99,56.09 26.67,56.09 | 69.64,51.65 69.64,58.31 C12.2 69.75,59.47 69.28,59.94 U3.1 65.79,59.94 63.18,62.55 63.18,75.88 v70.17,82.87 | U$1.VCC 40.01,87.41 v40.01,84.45 36.51,80.96 33.02,80.96 28.26,76.2 28.26,71.91 LED2.A 28.26,70.97 v28.26,69.85 26.67,68.26 26.67,63.82 B1.3.3V 26.67,60.01 26.67,56.09 | U6.2 57.85,55.63 v57.15,54.93 | 65.94,42.23 65.94,41.38 65.66,41.1 U$9.2 | R16.1 v70.8,46.77 | 26.67,56.09 26.67,49.31 C8.2
  Bottom 0.254: C11.2 62.55,45.4 | 62.55,45.4 J1.4 | 62.55,45.4 62.55,43.81 61.28,42.54 v59.05,42.54 | C13.2 26.99,64.13 B1.3.3V | v28.26,69.85 46.99,69.85 | 46.99,69.85 46.99,66.99 57.15,56.83 v57.15,54.93 | U$6.3 44.07,85.79 44.77,85.09 46.99,85.09 | v70.8,46.77 70.06,46.77 69.53,47.31 69.53,47.91 U1.5 | 3.3V.1 38.42,86.04 v40.01,84.45 | 46.99,69.85 OLED.2 46.99,85.09 | 46.99,85.09 50.48,85.09 57.15,91.76 68.9,91.76 71.75,88.9 71.75,84.45 v70.17,82.87
3.3V_MULTI  (via drill 0.6)
  Top 0.254: U$13.4 8.19,29.91 v7.3,30.8
  Bottom 0.254: U$12.P$10 2.26,80.68 1.59,80.01 1.59,62.27 | 1.59,62.27 1.59,43.85 | U$11.P$10 1.59,62.27 | U$10.P$10 1.59,43.85 | 1.59,43.85 1.59,36.51 v7.3,30.8
5V  (via drill 0.6)
  Top 0.254: U8.4 v31.75,63.82 | v47.62,64.45 47.94,64.77 U7.4 47.94,66.99 48.84,67.89 51.75,67.89 | 35.56,61.91 37.78,61.91 C4.2 38,61.91 39.31,61.91 | 35.56,61.91 30.48,61.91 29.53,62.86 v29.53,63.82 | C7.2 35.56,61.91 | C3.2 51.75,67.89 | U4.5 41.92,61.27 41.27,61.91 39.31,61.91 | U4.1 39.31,61.91 | C1.2 61.53,66.16 U2.14 59.37,67.89 | U$5.3 68.48,85.63 67.63,84.77 61.28,84.77 | U$8.3 54.2,85.5 54.93,84.77 61.28,84.77 | 61.28,84.77 61.28,79.06 59.37,77.15 59.37,67.89 | AN4.3 AN3.3 | 59.37,67.89 51.75,67.89 | U$9.4 60.58,36.45 60.01,35.88 57.15,35.88 56.52,36.51 56.52,38.1 | 56.52,38.1 50.8,38.1 49.85,39.05 49.85,49.21 51.12,50.48 U9.8 51.12,55.14 C19.1 51.22,56.08 R26.1 R10.1 R9.1 55.88,55.78 v55.35,55.24 | R8.1 R5.1 55.14,42.65 56.52,41.27 56.52,38.1
  Bottom 0.254: v29.53,63.82 v31.75,63.82 34.92,66.99 45.09,66.99 v47.62,64.45 55.35,56.73 v55.35,55.24 | v29.53,63.82 28.89,63.82 27.94,62.86 C2.2 27.2,61.81 B1.5V 26.99,57.15 26.99,34.29 AN6.3 AN5.3 | AN3.3 AN4.3 36.51,71.12 27.62,71.12 26.99,70.48 26.99,69.22 29.53,66.67 v29.53,63.82
A3
  Bottom 0.254: B1.A3 23.18,40.64 23.18,49.21 | 23.18,49.21 23.18,71.12 24.45,72.39 34.61,72.39 41.53,79.31 U$6.4 | R7.2 23.18,49.21
AN1
  Top 0.254: U8.12 32.41,58.44 31.43,57.47 28.89,57.47 27.62,58.74 27.62,66.67 31.12,70.17 40.64,70.17 AN4.1
AN2
  Top 0.254: U8.10 31.09,58.71 30.8,58.42 29.21,58.42 28.58,59.05 28.58,66.36 31.43,69.22 42.23,69.22 AN3.1
AN3
  Top 0.254: U8.5 31.09,66.33 33.02,68.26 44.45,68.26 50.8,74.61 50.8,83.95 49.12,85.63 U$8.1
AN4
  Top 0.254: U8.3 32.41,66.38 33.66,67.63 45.4,67.63 53.34,75.56 53.34,82.87 50.48,85.72 50.48,89.85 51.44,90.81 58.1,90.81 61.34,87.57 U$5.1
AN5  (via drill 0.6)
  Top 0.254: U7.12 48.6,61.25 v48.26,61.59
  Bottom 0.254: v48.26,61.59 44.13,65.72 35.24,65.72 34.61,65.09 34.61,63.18 33.66,62.23 30.48,62.23 29.53,61.28 29.53,58.42 28.58,57.47 AN6.1
AN6  (via drill 0.6)
  Top 0.254: U7.10 47.28,61.3 46.99,61.59 v46.36,61.59
  Bottom 0.254: AN5.1 29.84,39.05 29.84,52.39 32.38,54.93 41.91,54.93 46.36,59.37 v46.36,61.59
BRAKE_IN
  Bottom 0.254: R11.1 R3.1 66.67,75.88 68.52,77.72 U$7.1
CS_OLED
  Bottom 0.254: B1.D13 66.99,62.23 66.99,57.47 66.36,56.83 65.09,56.83 56.52,65.41 56.52,75.88 59.69,79.06 OLED.7
D4
  Bottom 0.254: B1.D4 74.61,45.72 74.61,79.06 73.34,80.33 R2.1
D5
  Bottom 0.254: J1.2 60.45,49.65 61.59,50.8 67.94,50.8 68.26,50.48 68.26,48.58 | 68.26,48.58 68.26,48.26 67.94,47.94 U1.1 | 68.26,48.58 71.12,48.58 B1.D5
D6  (via drill 0.6)
  Top 0.254: U$1.UART_RX v34.06,77.15 34.06,77.56 34.92,78.42 37.78,78.42 43.18,83.82 v48.26,83.82
  Bottom 0.254: B1.D6 68.26,53.97 63.5,53.97 53.34,64.13 53.34,83.19 52.7,83.82 v48.26,83.82 | v34.06,77.15 34.06,77.7 33.34,78.42 RX.1
D7  (via drill 0.6)
  Top 0.254: B1.D7 74.61,53.34 74.61,89.22 71.12,92.71 50.16,92.71 37.15,79.69 33.66,79.69 31.06,77.1 31.06,76.52 | U$1.UART_TX 31.06,76.52 | v32.7,76.52 31.06,76.52
  Bottom 0.254: TX.1 v32.7,76.52
D10
  Top 0.254: B1.D10 67.41,60.64 U3.2
D11
  Top 0.254: U3.6 73.01,63.19 B1.D11
D12  (via drill 0.6)
  Top 0.254: v69.22,61.91 69.2,61.9 U3.4
  Bottom 0.254: B1.D12 v69.22,61.91
GEAR_IN  (via drill 0.6)
  Top 0.254: U7.3 48.6,66.7 48.9,66.99 50.16,66.99 50.8,66.36 v57.79,66.36
  Bottom 0.254: v57.79,66.36 58.26,66.83 58.42,66.99 58.42,76.2 60.9,78.68 U$7.4
GND  (via drill 0.6)  (2 unrouted)
  Top 0.254: IC4.25 63.22,48.58 63.18,48.58
  other vias: 42.86,43.81 42.86,45.08 42.86,46.35 42.86,47.62 42.86,48.89 42.86,50.16 42.86,51.43 41.59,51.43 40.32,51.43 39.05,51.43 37.78,51.43 36.51,51.43 41.59,43.81 40.32,43.81 39.05,43.81 37.78,43.81 36.51,43.81 35.24,43.81 33.97,43.81 32.7,43.81 35.24,51.43 33.97,51.43 32.7,51.43 31.43,51.43 39.05,45.08 35.24,45.08 31.43,46.35 31.43,47.62 31.43,48.89 31.43,50.16 35.24,46.35 35.24,47.62 35.24,48.89 35.24,50.16 39.05,46.35 39.05,47.62 39.05,48.89 39.05,50.16 31.43,45.08 31.43,43.81 43.02,36.35 40.32,39.53 43.02,37.94 44.45,41.12 44.45,42.7 44.45,44.29 44.45,45.88 44.45,47.47 44.45,49.05 44.45,50.64 44.45,52.23 43.02,39.53 44.45,39.53 33.66,63.82 67.94,56.83 44.45,53.82 53.98,49.53
  pour Bottom: 74.61,97.47 75.56,96.52 75.56,29.84 74.61,28.89 27.3,28.89 24.77,31.43 23.49,31.43 22.23,32.7 22.23,73.34 27.94,73.34 27.94,89.85 33.66,89.85 34.92,91.12 34.92,96.52 35.88,97.47
  pour Top: 74.61,97.47 75.56,96.52 75.56,29.84 74.61,28.89 27.3,28.89 24.77,31.43 23.49,31.43 22.23,32.7 22.23,73.34 27.94,73.34 27.94,89.85 33.66,89.85 34.92,91.12 34.92,96.52 35.88,97.47
  pour Top: 75.56,27.94 59.69,27.94 59.69,0 75.56,0
  pour Bottom: 0,17.78 0,97.47 21.27,97.47 21.27,17.78
  pour Bottom: 59.69,27.94 75.56,27.94 75.56,0 59.69,0
  pour Top: 0,97.47 0,17.78 21.27,17.78 21.27,97.47
MISO_M0
  Bottom 0.254: JP1.1 52.7,37.78 53.02,38.1 53.02,44.13 60.64,51.75 68.58,51.75 69.53,50.8 69.53,49.88 U1.4
MOSI_M0  (via drill 0.6)
  Top 0.254: v55.25,40.96 v51.75,40.96
  Bottom 0.254: JP1.4 51.44,32.7 51.44,38.42 51.75,38.73 v51.75,40.96 51.75,44.45 59.37,52.07 59.37,56.83 52.07,64.13 OLED.4 | J1.3 61.55,44.4 61.28,44.13 58.42,44.13 v55.25,40.96
N$1
  Bottom 0.254: R2.2 73.34,88.9 69.53,92.71 56.52,92.71 51.37,87.57 U$6.1
N$2  (via drill 0.6)
  Top 0.254: U2.1 v64.5,67.89
  Bottom 0.254: v64.5,67.89 62.28,67.89 60.01,70.17 R6.2
N$3
  Top 0.254: U3.3 67.32,61.27 67.31,61.28 66.04,61.28 64.77,62.55 64.77,65.09 66.04,66.36 68.26,66.36 68.9,66.99 68.9,67.94 68.26,68.58 67.4,68.58 U2.2
N$4  (via drill 0.6)
  Top 0.254: U2.3 v65.75,69.19
  Bottom 0.254: v65.75,69.19 63.52,69.19 62.23,70.48 R4.2
N$5  (via drill 0.6)
  Top 0.254: U3.7 68.94,63.86 70.8,65.72 70.8,70.8 v68.48,73.13
  Bottom 0.254: R3.2 v68.48,73.13
N$6
  Top 0.254: LED2.C R1.1
N$7
  Top 0.254: IC4.11 63.75,44.52 64.24,44.03 R13.2
N$8  (via drill 0.6)
  Top 0.254: U$1.NC@5 v35.56,76.52
  Bottom 0.254: v35.56,76.52 35.56,78.42 33.66,80.33 P2_1-(6).1
N$9  (via drill 0.6)
  Top 0.254: U$1.RESETB 37.06,85.32 v35.88,84.14
  Bottom 0.254: v35.88,84.14 RESET-(4).1
N$10
  Bottom 0.254: J1.7 65.95,48.48 66.36,48.89 U1.2
N$11
  Top 0.254: L1.1 38,37.15 C10.2 37.05,37.36 36.51,36.83 R19.2
N$12
  Top 0.254: U8.2 U8.1 33.71,66.41 34.29,66.99 40.96,66.99 41.26,66.69 U4.13
N$13
  Top 0.254: IC4.9 62.75,44.65 62.13,44.03 C14.2
N$14
  Top 0.254: IC4.4 60.39,46.74 59.48,45.82 R18.2
N$15
  Top 0.254: IC4.26 62.75,50.05 63.46,50.76 U$2.2 63.46,54.67 C5.2
N$16
  Top 0.254: IC4.27 62.25,49.51 60.96,50.8 U$2.1 C6.2
N$17
  Top 0.254: IC4.17 66.19,46.74 R17.2
N$18  (via drill 0.6)
  Top 0.254: U$1.NC@6 v37.06,77.06
  Bottom 0.254: P2_2-(5).1 34.29,82.23 37.06,79.46 v37.06,77.06
N$19
  Top 0.254: U$3.9 39.49,40.13 38.73,39.37 35.88,39.37 34.61,38.1 34.61,32.57 R19.1
N$20
  Top 0.813: U$3.11 41.7,37.15 | 41.7,37.15 41.7,33.77 X3.1 | L1.2 41.7,37.15
N$21
  Top 0.254: U3.5 66.34,62.56 65.72,63.18 65.72,64.77 66.36,65.41 68.58,65.41 69.85,66.67 69.85,68.58 68.58,69.85 U2.4
N$22
  Top 0.254: U6.6 58.36,60.39 57.47,61.28 54.71,61.28 R26.2 51.86,58.42 40.96,58.42 40.63,58.75 U4.3
N$23
  Top 0.254: U6.5 58.86,58.86 57.79,57.78 53.98,57.78 | R10.2 53.98,57.78 | 53.98,57.78 40.64,57.78 39.97,58.46 U4.2
N$24
  Top 0.254: U7.1 U7.2 49.24,64.48 48.26,63.5 44.77,63.5 43.88,64.39 U4.9
N$25
  Top 0.254: U7.6 U7.7 45.99,66.73 45.72,66.99 43.5,66.99 43.22,66.71 U4.10
N$26  (via drill 0.6)
  Top 0.254: U4.11 42.56,64.12 v42.86,63.82 | 44.77,61.33 v44.77,61.59 44.77,60.64 45.47,59.94 U7.8 U7.9
  Bottom 0.254: v42.86,63.82 44.77,61.91 v44.77,61.59
N$27
  Top 0.254: U7.14 U7.13 49.24,61.89 48.26,62.86 42.55,62.86 41.92,63.49 U4.12
N$28
  Top 0.254: U6.7 U6.8 55.88,59.52 | C17.1 55.88,59.52 | 55.88,59.52 R9.2
N$29
  Top 0.254: U8.7 U8.6 30.48,65.76 30.48,63.18 31.12,62.55 40.01,62.55 40.63,63.17 U4.14
N$30  (via drill 0.6)
  Top 0.254: v37.47,60.01 34.92,60.01 33.97,60.96 30.8,60.96 30.45,60.62 U8.9 U8.8 | U4.15 39.97,63.78 v39.69,63.5
  Bottom 0.254: v37.47,60.01 37.47,61.28 v39.69,63.5
N$31  (via drill 0.6)
  Top 0.254: U8.14 U8.13 33.02,59.92 | 33.77,60.01 U8.14 | v35.56,64.77 36.58,65.79 U4.16 | v35.56,58.74 34.59,58.74 U8.14
  Bottom 0.254: v35.56,64.77 v35.56,58.74
N$37
  Top 0.254: U10.8 70.17,15.87 69.75,15.45 C20.1 70.17,10.06 JP5.4
N$41
  Bottom 0.254: JP5.2 65.09,11.01 C9.2 65.09,11.21 65.09,13.23 R14.1 65.09,13.44 65.09,15.66 | U5.P$3 65.09,15.66 | 65.09,15.66 R12.1 65.09,15.14
N$42
  Top 0.254: JP5.3 67.63,10.06 C20.2 68.05,11.64 67.63,12.06 U10.4
RPM_IN
  Bottom 0.254: R6.1 60.01,75.88 63.44,79.31 U$7.3
RST_OLED
  Bottom 0.254: B1.D8 72.39,54.93 63.82,54.93 54.61,64.13 OLED.5
RX
  Top 0.254: U$3.20 33.2,55.42 33.66,55.88 46.67,55.88 47.94,54.61 47.94,38.42 50.16,36.2 53.98,36.2 56.2,33.97 B1.RX
SCL_M0  (via drill 0.6)
  Top 0.254: IC4.19 66.88,47.74 66.99,47.62 68.9,47.62 69.53,48.26 69.53,49.21 68.8,49.95 R15.2 67.21,49.95 66.36,50.8 66.36,53.66 66.99,54.29 68.26,54.29 68.89,54.92 IC1.1 68.89,59.06 68.58,59.37 v64.45,59.37 60.33,59.37 58.36,57.4 U6.3 58.36,54.55 57.79,53.97 53.02,53.97 52.39,53.34 U9.7
  Bottom 0.254: B1.SCL 69.53,74.93 69.53,68.58 64.45,63.5 v64.45,59.37
SCL_M0_SENSOR
  Top 0.254: U10.6 U10.5 71.36,11.19 72.71,9.84 JP5.5
SCL_MLX
  Top 0.254: U$9.1 68.2,36.45 67.63,35.88 62.55,35.88 61.91,36.51 61.91,40.64 61.28,41.27 58.42,41.27 56.2,43.5 56.2,44.35 | U9.6 U9.5 55.32,51.68 56.2,50.8 56.2,44.35 | R8.2 56.2,44.35
SCL_MLX_SENSOR
  Top 0.254: U10.7 72.71,14.6 73.34,15.24 73.34,18.41 U5.P$1
  Bottom 0.254: R12.2 68.58,15.56 70.17,17.14 U5.P$1
SCL_MULTI
  Top 0.254: U$12.P$4 2.26,85.76 1.59,85.09 1.59,67.35 | 1.59,67.35 1.59,48.93 U$10.P$4 1.62,48.93 1.59,48.89 1.59,36.51 5.71,32.38 5.71,27.11 U$13.5 | U$11.P$4 1.59,67.35
SCLK_M0  (via drill 0.6)
  Top 0.254: v54.29,39.37 v50.8,39.37
  Bottom 0.254: JP1.3 50.16,38.73 v50.8,39.37 50.8,44.77 58.42,52.39 58.42,56.83 49.53,65.72 OLED.3 | J1.5 63.75,43.43 61.28,40.96 58.1,40.96 56.52,39.37 v54.29,39.37
SDA_M0  (via drill 0.6)
  Top 0.254: R16.2 67.87,48.55 IC4.20 65.72,48.58 65.72,55.56 | 65.72,55.56 v65.72,57.78 65.41,58.1 60.64,58.1 59.22,56.68 U6.4 58.86,54.1 57.79,53.02 v56.83,53.02 | IC1.3 66.97,55.56 65.72,55.56 | U9.1 v51.12,48.58
  Bottom 0.254: B1.SDA 70.8,73.66 70.8,67.94 65.72,62.86 v65.72,57.78 | v51.12,48.58 51.12,49.21 49.85,50.48 49.85,52.39 50.48,53.02 v56.83,53.02
SDA_M0_SENSOR
  Top 0.254: U10.2 U10.3 64.14,13.33 62.55,11.75 JP5.1
SDA_MLX
  Top 0.254: U9.3 U9.2 | U9.2 52.4,46.75 | U$9.5 58.04,40.7 55.25,43.5 53.02,43.5 52.17,44.35 R5.2 52.07,45.08 52.39,45.4 U9.2
SDA_MLX_SENSOR
  Top 0.254: U5.P$2 67.63,21.59 64.45,18.41 64.45,16.51 65.09,15.87 U10.1
  Bottom 0.254: R14.2 69.22,13.33 72.39,16.51 72.39,22.22 70.48,24.13 U5.P$2
SDA_MULTI  (via drill 0.6)
  Top 0.254: U$13.1 v15.81,32.45
  Bottom 0.254: U$12.P$3 6.31,78.14 6.98,77.47 6.98,59.73 | 6.98,59.73 6.98,41.31 | U$10.P$3 6.98,41.31 | U$11.P$3 6.98,59.73 | 6.98,41.31 6.98,38.73 9.84,35.88 12.38,35.88 v15.81,32.45
SPEED_IN
  Bottom 0.254: R4.1 62.23,75.88 65.98,79.63 U$7.2
SPI_DC_M0
  Bottom 0.254: B1.D9 70.8,55.88 64.45,55.88 55.56,64.77 55.56,76.84 57.15,78.42 OLED.6
THROTTLE_IN  (via drill 0.6)
  Top 0.254: U7.5 47.28,67.28 55.82,75.82 v55.82,78.99
  Bottom 0.254: U$7.5 58.36,85.66 55.82,83.12 v55.82,78.99
TX
  Top 0.254: B1.TX 70.17,36.51 68.58,34.92 56.52,34.92 54.29,37.15 50.48,37.15 48.9,38.73 48.9,55.24 47.31,56.83 33.02,56.83 32.09,55.91 U$3.21
VBATT  (via drill 0.6)
  Top 0.254: U$3.22 v30.99,56.08
  Bottom 0.254: v30.99,56.08 32.12,57.2 U$4.+$1
VIN_MULTI
  Top 0.254: U$12.P$5 6.31,83.22 6.98,82.55 6.98,64.81 | 6.98,64.81 6.98,46.39 | 6.98,46.39 6.98,38.73 9.84,35.88 12.38,35.88 13.27,34.99 U$13.2 | U$10.P$5 6.98,46.39 | U$11.P$5 6.98,64.81

### Text on the board
tPlace: DAWA | v5.1 | Data / Acquisition / With / Arduino | SW | SW | LED- | LED+ | THROTLE | GEAR | RPM | SPEED | BRAKE | AN3 | GND | 5v | AN4 | GND | 5v | 5v | SCL | GND | SDA | AN1/2 | GND | 3.3V | 5V | GND | VIN | SDA | 5v | GND | 3.3v | SCL | I2C | AN5/6 | GND | 5v | SCL | 3.3v | GND | 5v | SDA | SDA | 3.3v | GND | 5v | SCL
bPlace: GND | 3.3V | CLK | MOSI | RESET | DC | CS | TX | MOSI | CLK | MISO | RX | T568B pinouts / SDA > 2 > Orange / SCL > 8 > Brown / 3.3v > 4 > Blue / VIN > 6 > Green / GND > 5 > W & Blue